# EAGLE design DELAY (EAGLE 7.2.0)
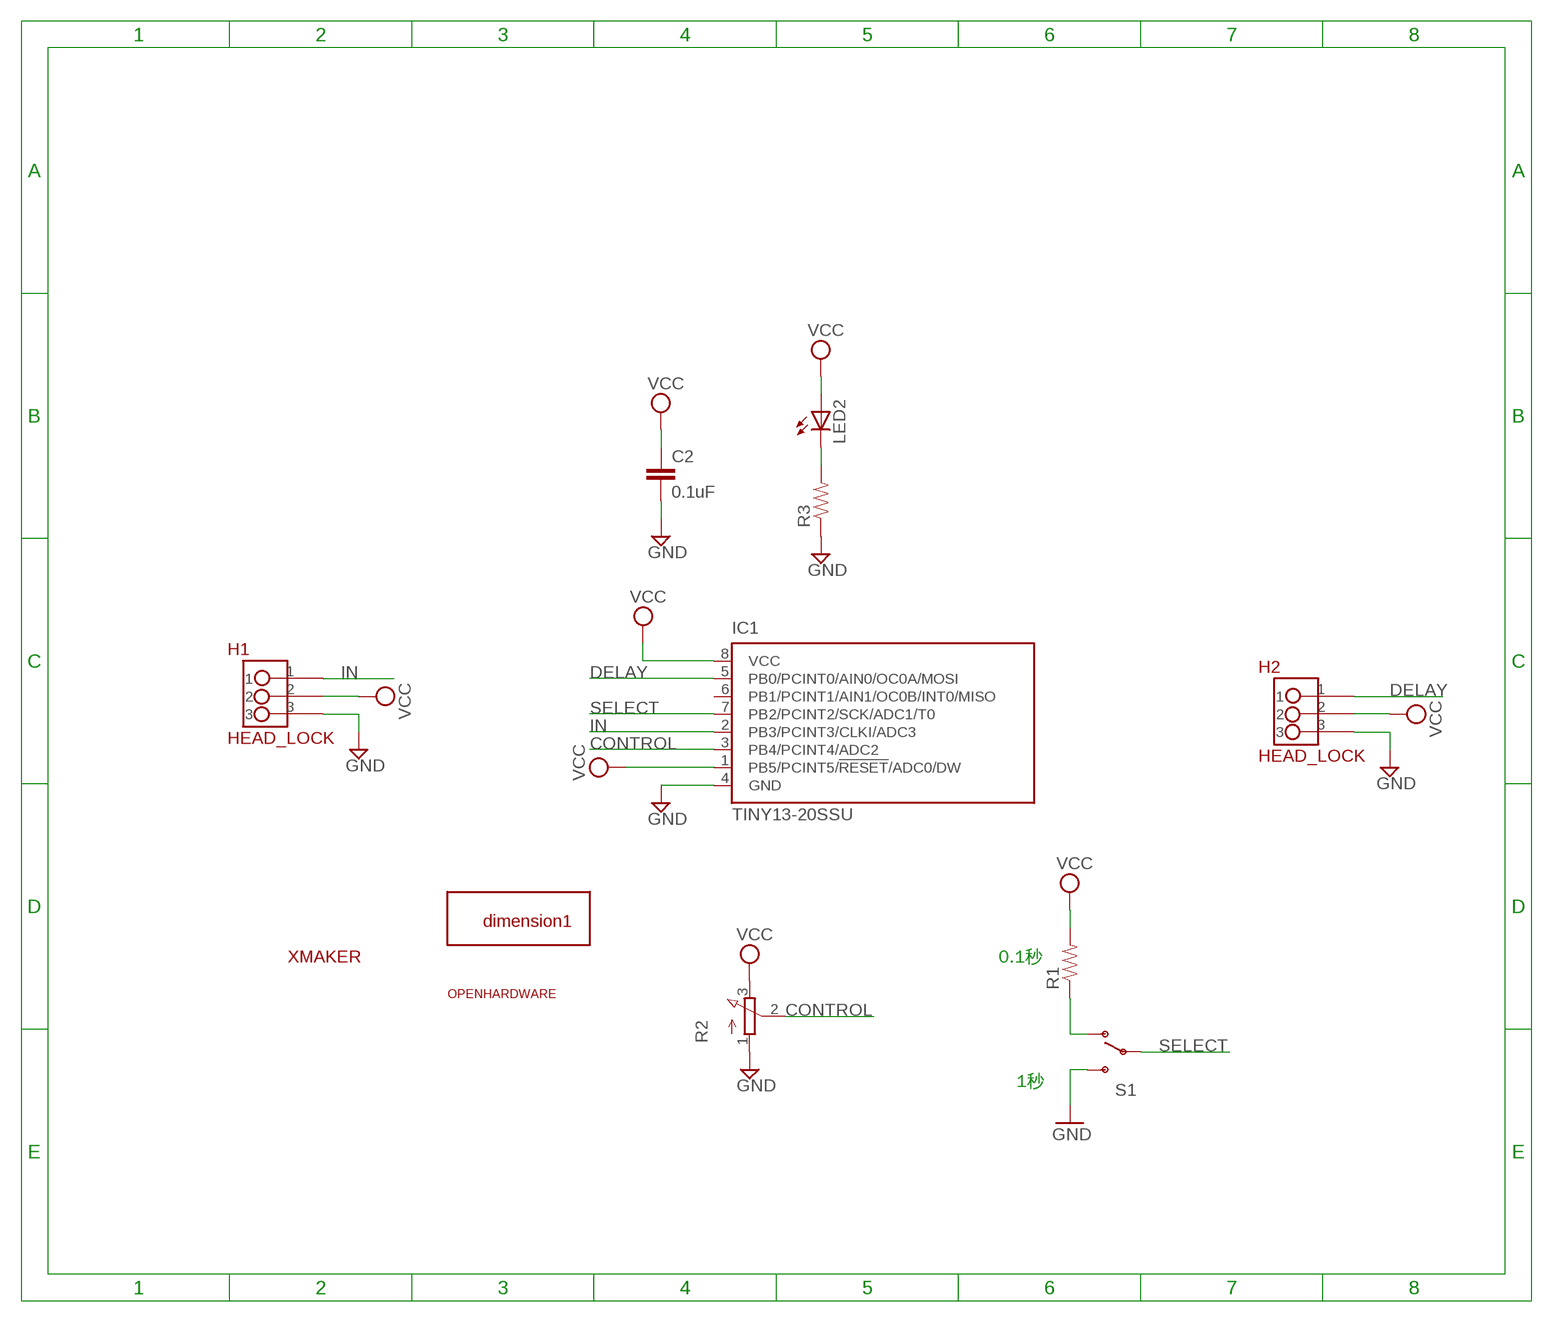
[diagram p0: schematic, sheet 1]

## Parts
C2  0.1uF  CAP0603-CAP  [0603-CAP]
H1  HEAD_LOCK  [HEAD_LOCK]
H2  HEAD_LOCK  [HEAD_LOCK]
IC1  TINY13-20SSU  [8S1]
LED2  LED_ESML0603  [LED_SML0603]
R1  RESISTOR0603-RES  [0603-RES]
R2  3RP/1610N  [3RP/1610N]
R3  0.27OHM-1/10W-1%(0603)  [0603-RES]
S1  SWITCH-SPDTKIT  [SWITCH-SPDT_KIT]
U$1  XMAKERLOGO2  [XMAKERLOGO2]
U$2  DIMENSION1  [DIMENSION1]
U$3  OPENHARDWARE  [OPENHARDWARE]

## Nets
CONTROL: IC1.3(PB4/PCINT4/ADC2) R2.2(S)
DELAY: H2.1 IC1.5(PB0/PCINT0/AIN0/OC0A/MOSI)
GND: C2.2 H1.3 H2.3 IC1.4(GND) R2.1(A) R3.1 S1.3(S)
IN: H1.1 IC1.2(PB3/PCINT3/CLKI/ADC3)
N$1: R1.1 S1.1(O)
N$2: LED2.C R3.2
SELECT: IC1.7(PB2/PCINT2/SCK/ADC1/T0) S1.2(P)
VCC: C2.1 H1.2 H2.2 IC1.1(PB5/PCINT5/!RESET!/ADC0/DW) IC1.8(VCC) LED2.A R1.2 R2.3(E)
Unconnected: IC1.6(PB1/PCINT1/AIN1/OC0B/INT0/MISO)

## Notes on the sheet
- 0.1秒
- 1秒

## Library data of the parts
C2 = SparkFun-Passives:CAP: Capacitor Standard 0603 ceramic capacitor, and 0.1" leaded capacitor.
H1 H2 = HEAD_LOCK:HEAD_LOCK: 带锁的排座
IC1 = atmel:TINY13: 8-bit AVR Microcontroller with 1K Bytes In-System Programmable Flash Source: http://www.atmel.com/dyn/resources/prod_documents/2535S.pdf; MPN: ATTINY13-20SSU; OC_FARNELL: 1455133; OC_NEWARK: 58M3771
LED2 = eagle-ltspice:LED_E: LED Source: http://www.osram.convergy.de Source: www.luxeon.com Source: www.kingbright.com; SPICEMODEL: NONE; SPICEPREFIX: D; SPICETYPE: diode
R1 = SparkFun-Passives:RESISTOR: Resistor Basic schematic elements and footprints for 0603, 1206, and PTH resistors.
R2 = pot:3RP/1610N: 16mm Potentiometer one level Source: http://www.alphapotentiometers.net/html/16mm_pot_2.html
R3 = SparkFun-Resistors:0.27OHM-1/10W-1%(0603): RES-08787; PROD_ID: RES-08787
S1 = SparkFun-Electromechanical:SWITCH-SPDT: SPDT Switch Simple slide switch, Spark Fun Electronics SKU : COM-00102 DPDT SMT slide switch, AYZ0202, SWCH-08179; PROD_ID: SWCH-08261
U$1 = Xmaker_yuhui:XMAKERLOGO2
U$2 = Xmaker_yuhui:DIMENSION1
U$3 = Xmaker_yuhui:OPENHARDWARE

## Board
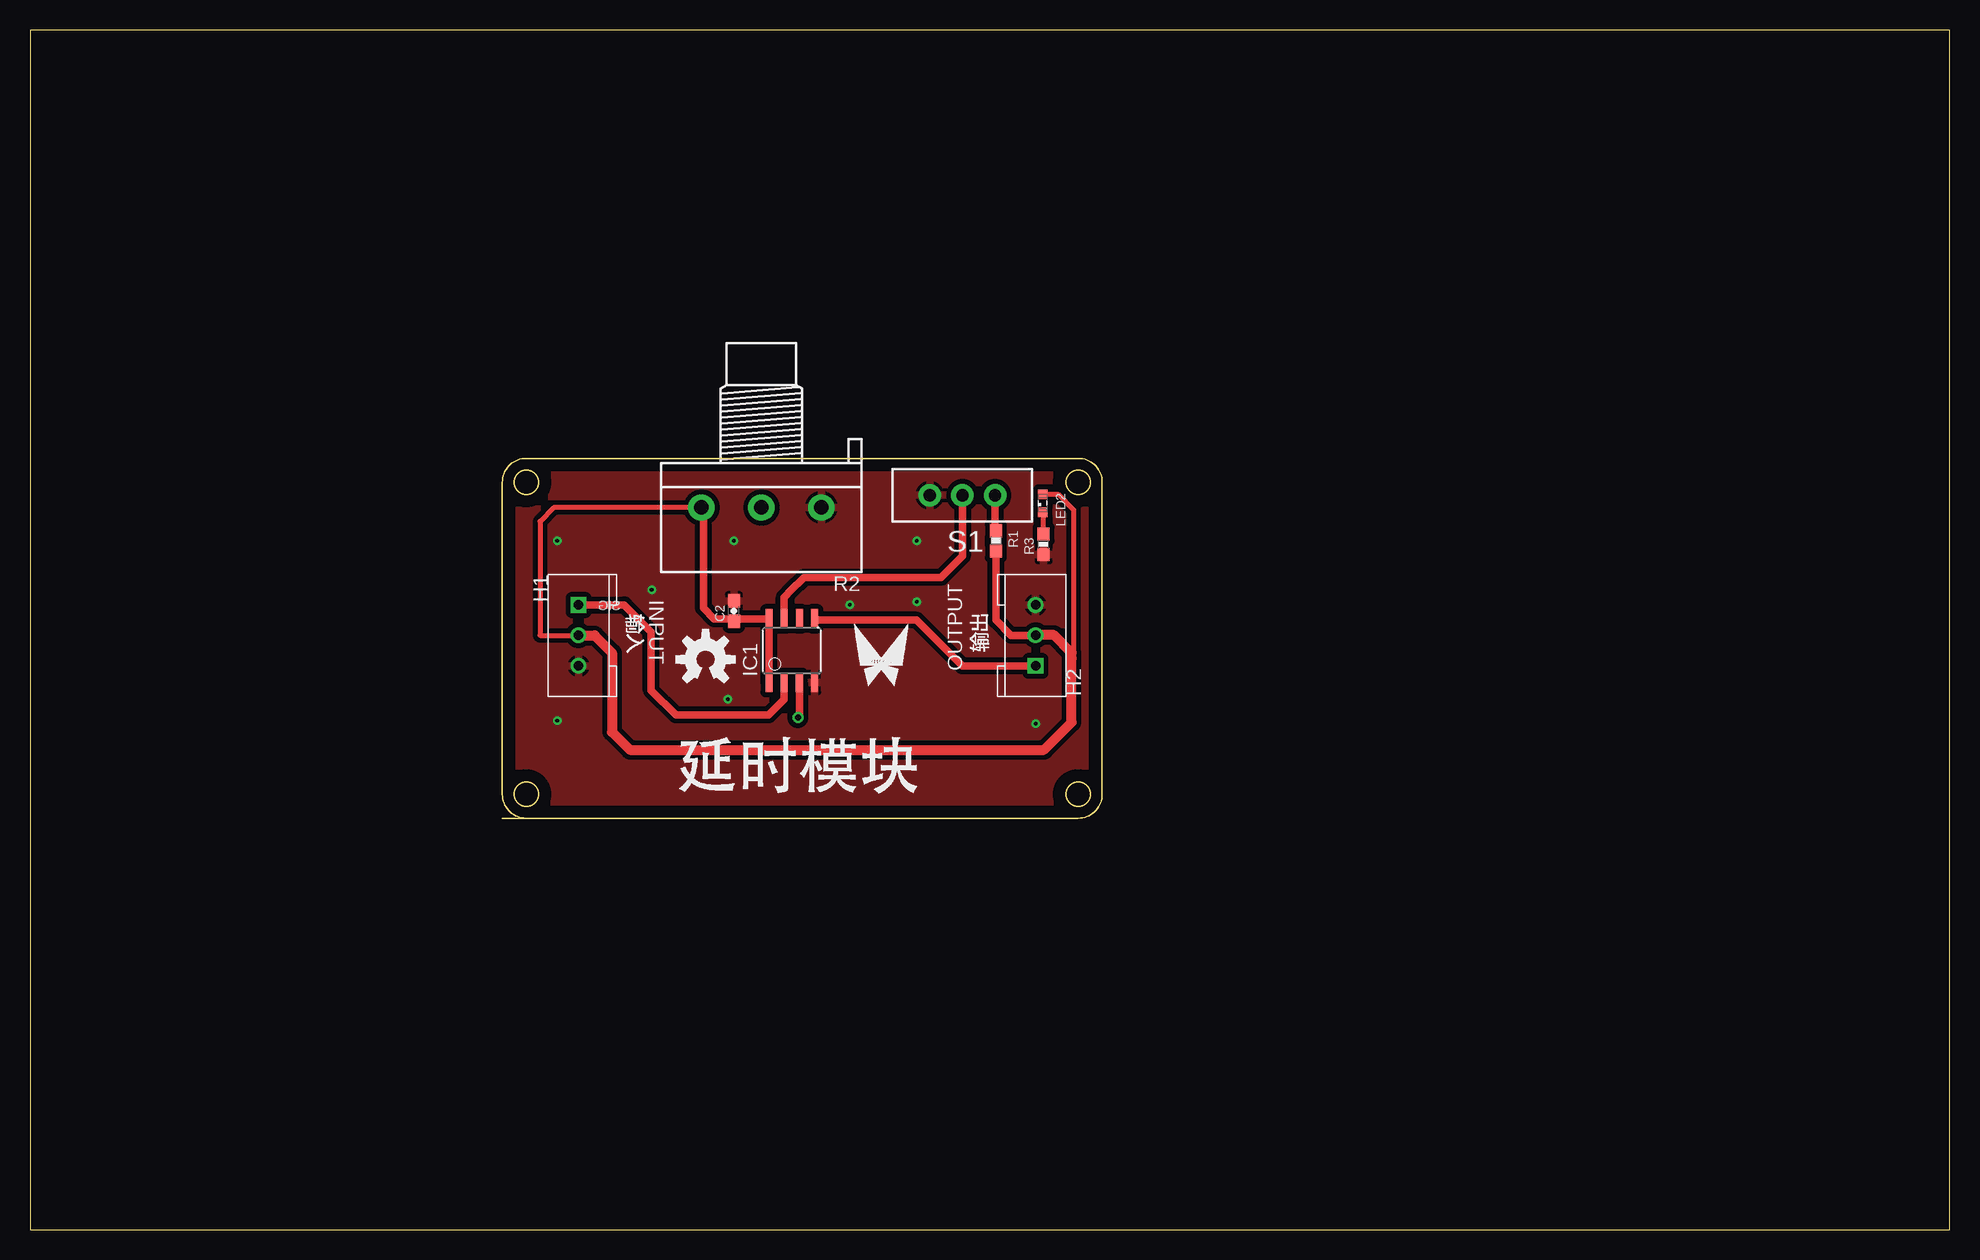
[diagram p1: board, top side]
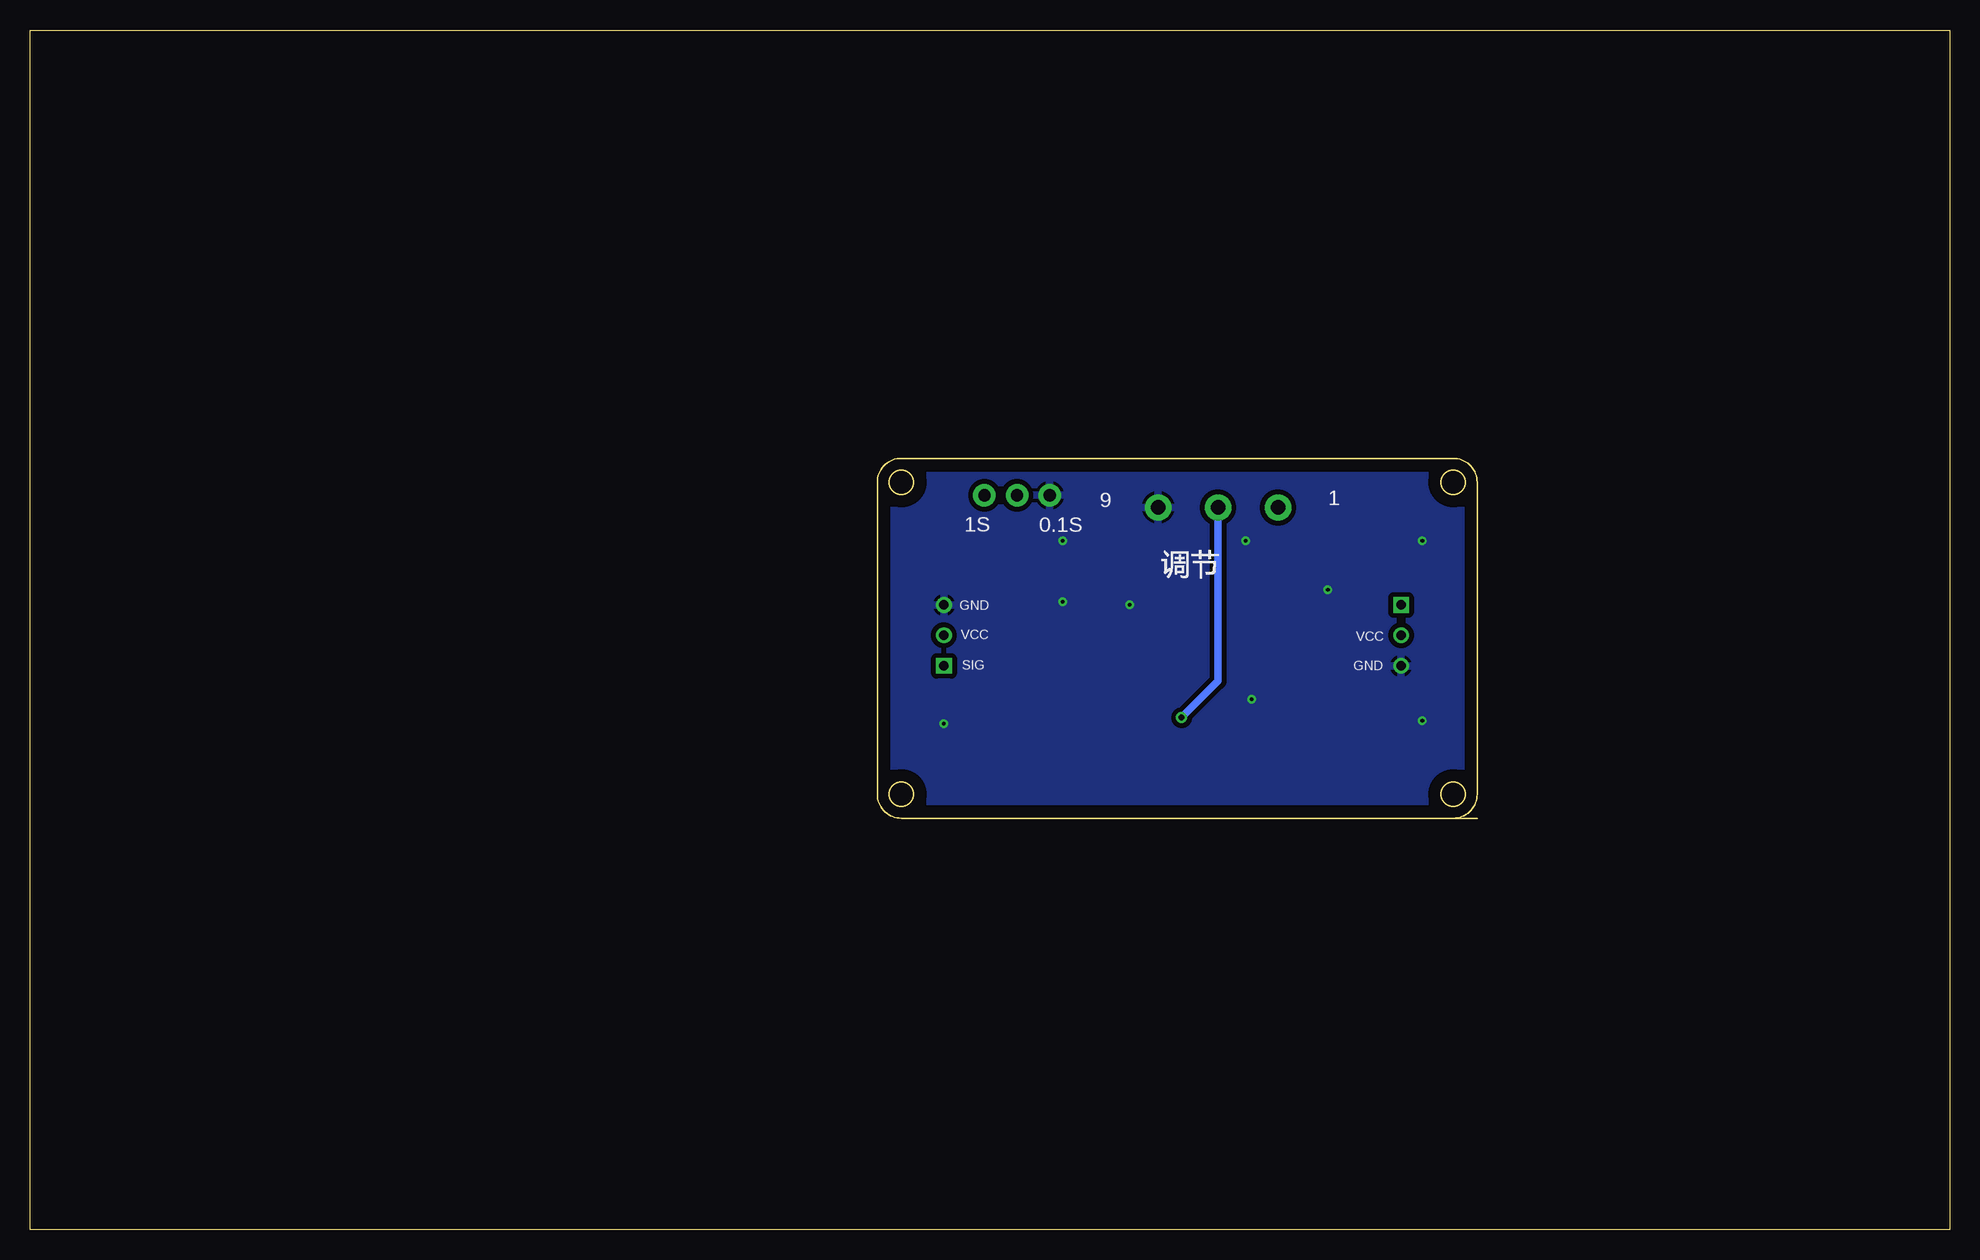
[diagram p2: board, bottom side, seen from below]

Size 160 x 100 mm. Coordinates in mm from the lower left corner, seen from the top.
Outline: 0,0 160,0 160,100 0,100 0,0
Copper layers (1*16): Top 0.035mm / dielectric 1.5mm / Bottom 0.035mm
Design rules "default": minimum track width 10mil, minimum drill 24mil, track to track 8mil, track to pad 8mil, pad to pad 8mil, via to via 8mil, smd to smd 8mil, copper to edge 40mil, drill to drill 8mil, minimum pad ring 10mil, minimum via ring 8mil, stop-mask expansion 4mil, vias tented up to drill 0mil, thermal gap 10mil

### Footprints (pad centres in the part's own frame; a part is rotated, then mirrored left to right if it is on the bottom)
0603-CAP = smd 1.1 x 1: 1 -0.85,0; 2 0.85,0
HEAD_LOCK = drill 0.8 square: 1 0,0 | drill 0.8: 2 2.54,0; 3 5.08,0
8S1 = smd 0.6 x 1.6: 1 -1.905,-2.654; 2 -0.645,-2.654; 3 0.625,-2.654; 4 1.895,-2.654; 5 1.905,2.654; 6 0.635,2.654; 7 -0.635,2.654; 8 -1.905,2.654
LED_SML0603 = smd 0.8 x 0.8: A 0.75,0; C -0.75,0
0603-RES = smd 1.1 x 1: 1 -0.85,0; 2 0.85,0
3RP/1610N = drill 1.2 pad 2.184: 1 -5,0; 2 0,0; 3 5,0
SWITCH-SPDT_KIT = drill 1.016 pad 1.88: 1 0,2.718; 2 0,0; 3 0,-2.718

### Placement (x,y rotation side)
C2  58.67,51.56 90 top
H1  45.72,52.07 270 top
H2  83.82,46.99 90 top
IC1  63.5,48.26 0 top
LED2  84.43,60.55 90 top
R1  80.52,57.4 270 top
R2  60.96,60.2 180 top
R3  84.48,57.12 90 top
S1  77.72,61.21 270 top
U$1  67.44,44.37 0 top
U$2  39.37,34.29 0 top
U$3  56.31,47.52 0 top

### Tracks (layer width: path | path; a pad name or v marks a point on that pad's centre or on a via)
CONTROL  (via drill 0.51)
  Top 0.61: IC1.3 64.12,42.79 v64.01,42.67
  Bottom 0.61: R2.2 60.96,45.72 v64.01,42.67
DELAY
  Top 0.61: H2.1 77.72,46.99 73.91,50.8 65.52,50.8 IC1.5
GND  (via drill 0.3)
  other vias: 43.94,42.42 58.17,44.2 83.82,42.16 43.94,57.4 51.82,53.34 58.67,57.4 68.33,52.07 73.91,52.32 73.91,57.4
  pour Top (isolate 0.406): 38.1,66.04 91.44,66.04 91.44,32.77 38.1,32.77
  pour Bottom (isolate 0.406): 37.85,66.04 91.44,66.04 91.44,32.77 37.85,32.77
IN
  Top 0.61: H1.1 49.53,52.07 51.79,49.81 51.79,44.96 53.85,42.9 61.57,42.9 62.85,44.19 IC1.2
N$1
  Top 0.61: S1.1 80.44,58.33 R1.1
N$2
  Top 0.406: LED2.C 84.43,58.02 R3.2
SELECT
  Top 0.61: S1.2 77.72,56.13 75.95,54.36 64.52,54.36 63.37,53.21 62.99,52.83 62.87,52.7 IC1.7
VCC
  Top 0.406: LED2.A 85.69,61.3 87,59.99 87,47.8 86.82,47.62 | 56.13,51.82 56.13,59.84 55.8,60.17 43.66,60.17 42.52,59.03 42.52,49.53 H1.2
  Top 0.61: IC1.1 IC1.8 58.88,50.91 | 58.88,50.91 C2.1 | H2.2 81.79,49.53 80.52,50.8 R1.2 | 58.88,50.91 57.04,50.91 56.13,51.82 56.13,60.02 R2.3
  Top 0.813: H1.2 47.07,49.53 48.51,48.08 48.51,41.48 50.01,39.98 84.51,39.98 86.82,42.29 86.82,47.62 86.82,48.08 85.34,49.55 83.84,49.55 H2.2

### Text on the board
tPlace: INPUT | SIG | OUTPUT | C:/Users/Xiangzi/Desktop/Ãû³Æ/ADJUST.bmp | C:/Users/Xiangzi/Desktop/Ãû³Æ/Êä³ö.bmp | C:/Users/Xiangzi/Desktop/Ãû³Æ/ÊäÈë.bmp | C:/Users/Xiangzi/Desktop/Ãû³Æ/ÑÓʱģ¿é.bmp
bPlace: 1 | 9 | 0.1S | 1S | GND | VCC | VCC | GND | SIG